# EAGLE design Softkey-bar (EAGLE 9.6.2)
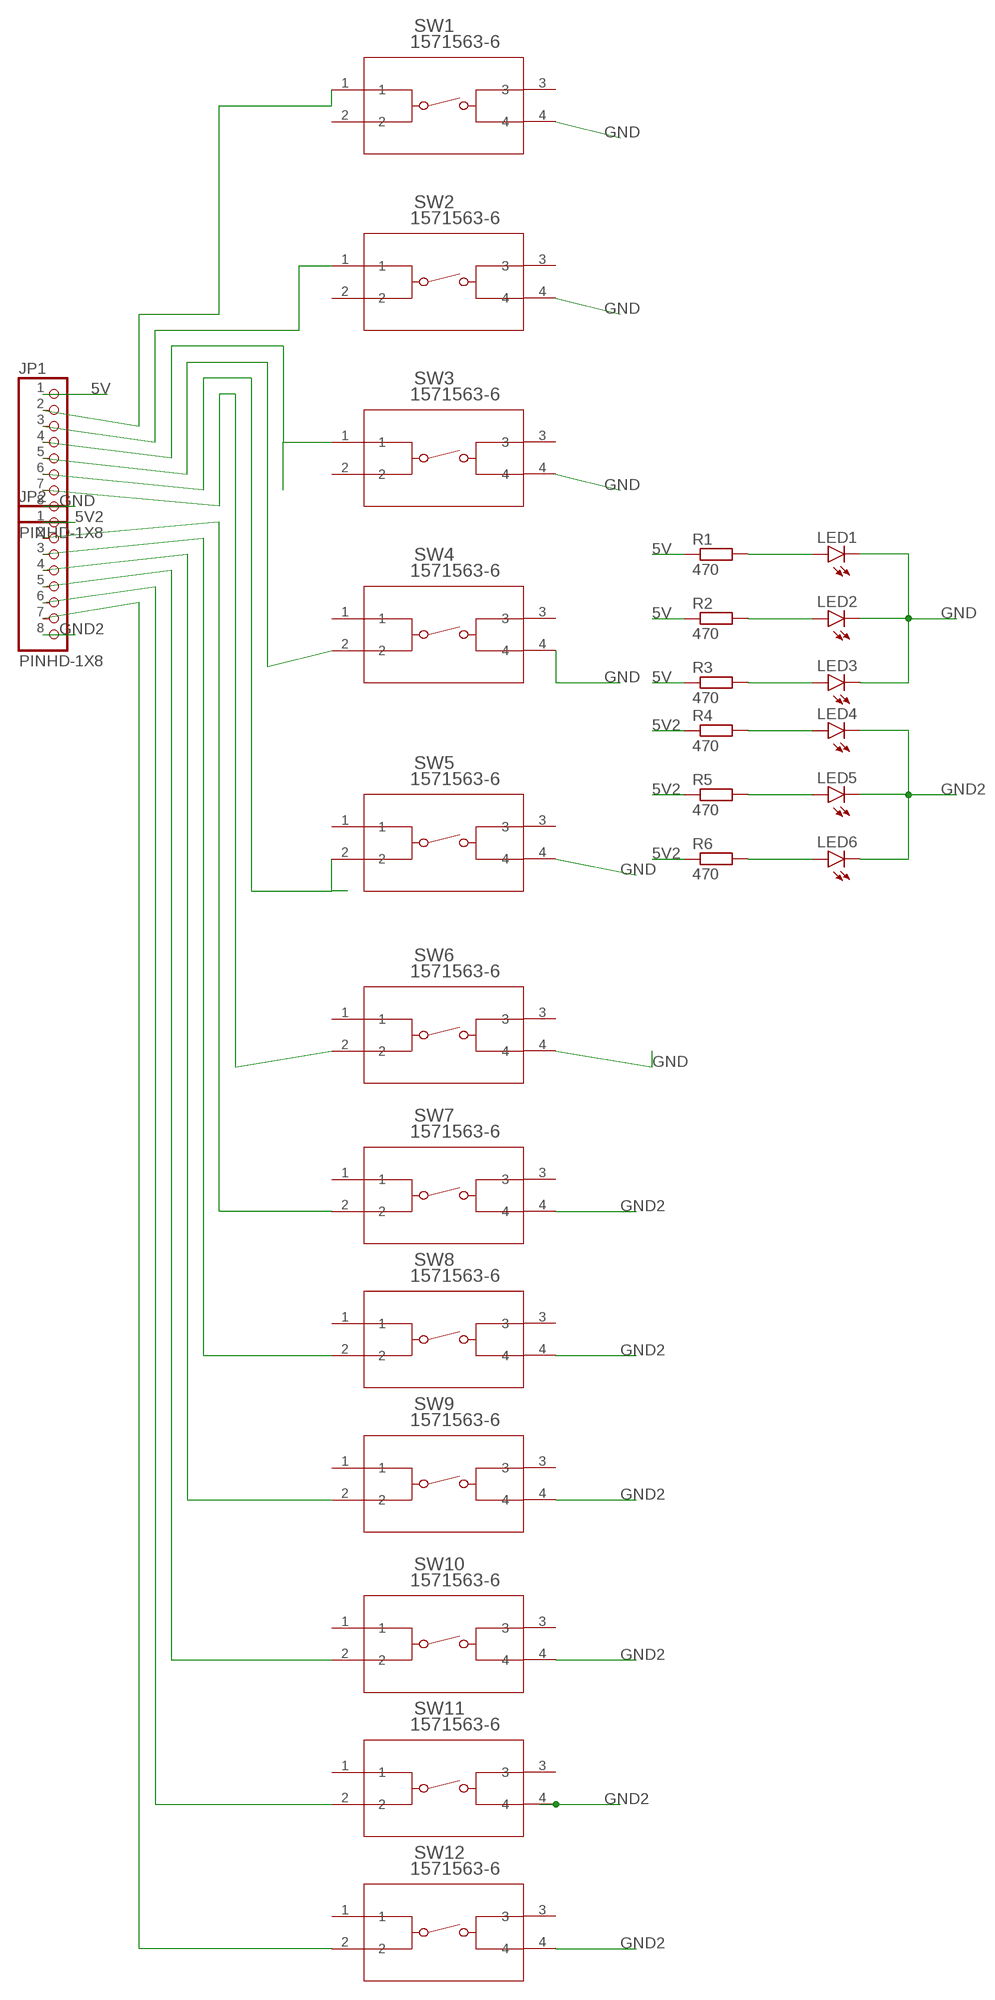
[diagram p0: schematic, sheet 1]

## Parts
JP1  PINHD-1X8  [1X08]
JP2  PINHD-1X8  [1X08]
LED1  LEDCHIPLED_1206  [CHIPLED_1206]
LED2  LEDCHIPLED_1206  [CHIPLED_1206]
LED3  LEDCHIPLED_1206  [CHIPLED_1206]
LED4  LEDCHIPLED_1206  [CHIPLED_1206]
LED5  LEDCHIPLED_1206  [CHIPLED_1206]
LED6  LEDCHIPLED_1206  [CHIPLED_1206]
R1  470  R-EU_R0805  [R0805]
R2  470  R-EU_R0805  [R0805]
R3  470  R-EU_R0805  [R0805]
R4  470  R-EU_R0805  [R0805]
R5  470  R-EU_R0805  [R0805]
R6  470  R-EU_R0805  [R0805]
SW1  1571563-6  [SW4_1437565-E]
SW2  1571563-6  [SW4_1437565-E]
SW3  1571563-6  [SW4_1437565-E]
SW4  1571563-6  [SW4_1437565-E]
SW5  1571563-6  [SW4_1437565-E]
SW6  1571563-6  [SW4_1437565-E]
SW7  1571563-6  [SW4_1437565-E]
SW8  1571563-6  [SW4_1437565-E]
SW9  1571563-6  [SW4_1437565-E]
SW10  1571563-6  [SW4_1437565-E]
SW11  1571563-6  [SW4_1437565-E]
SW12  1571563-6  [SW4_1437565-E]

## Nets
5V: JP1.1 R1.1 R2.1 R3.1
5V2: JP2.1 R4.1 R5.1 R6.1
GND: JP1.8 LED1.C LED2.C LED3.C SW1.4 SW2.4 SW3.4 SW4.4 SW5.4 SW6.4
GND2: JP2.8 LED4.C LED5.C LED6.C SW7.4 SW8.4 SW9.4 SW10.4 SW11.4 SW12.4
N$1: JP1.2 SW1.1
N$2: JP1.3 SW2.1
N$3: JP1.4 SW3.1
N$4: JP1.5 SW4.2
N$5: JP1.6 SW5.2
N$6: JP1.7 SW6.2
N$7: LED1.A R1.2
N$8: LED2.A R2.2
N$9: LED3.A R3.2
N$10: LED4.A R4.2
N$11: LED5.A R5.2
N$12: LED6.A R6.2
N$16: JP2.2 SW7.2
N$17: JP2.3 SW8.2
N$18: JP2.4 SW9.2
N$19: JP2.5 SW10.2
N$20: JP2.6 SW11.2
N$21: JP2.7 SW12.2
Unconnected: SW1.2 SW1.3 SW2.2 SW2.3 SW3.2 SW3.3 SW4.1 SW4.3 SW5.1 SW5.3 SW6.1 SW6.3 SW7.1 SW7.3 SW8.1 SW8.3 SW9.1 SW9.3 SW10.1 SW10.3 SW11.1 SW11.3 SW12.1 SW12.3

## Library data of the parts
JP1 JP2 = Connector:PINHD-1X8: PIN HEADER; CATEGORY: CONNECTOR; SUB-CATEGORY: PIN-HEADER
LED1-LED6 = led:LED: LED OSRAM: - CHIPLED LG R971, LG N971, LY N971, LG Q971, LY Q971, LO R971, LY R971 LH N974, LH R974 LS Q976, LO Q976, LY Q976 LO Q996 - Hyper CHIPLED LW Q18S LB Q993, LB Q99A, LB R99A - SideLED LS A670, LO A670, LY A670, LG A670, LP A670 LB A673, LV A673, LT A673, LW A673 LH A674 LY A675 LS A676, LA A676, LO A676, LY A676, LW A676 LS A679, LY A679, LG A679 - Hyper Micro SIDELED® LS Y876, LA Y876, LO Y876, LY Y876 LT Y87S - SmartLED LW L88C, LW L88S LB L89C, LB L89S, LG L890 LS L89K, LO L89K, LY L89K LS L896, LA L896, LO L896, LY L896 - TOPLED LS T670, LO T670, LY T670, LG T670, LP T670 LSG T670, LSP T670, LSY T670, LOP T670, LYG T670 LG T671, LOG T671, LSG T671 LB T673, LV T673, LT T673, LW T673 LH T674 LS T676, LA T676, LO T676, LY T676, LB T676, LH T676, LSB T676, LW T676 LB T67C, LV T67C, LT T67C, LS T67K, LO T67K, LY T67K, LW E67C LS E67B, LA E67B, LO E67B, LY E67B, LB E67C, LV E67C, LT E67C LW T67C LS T679, LY T679, LG T679 LS T770, LO T770, LY T770, LG T770, LP T770 LB T773, LV T773, LT T773, LW T773 LH T774 LS E675, LA E675, LY E675, LS T675 LS T776, LA T776, LO T776, LY T776, LB T776 LHGB T686 LT T68C, LB T68C - Hyper Mini TOPLED® LB M676 - Mini TOPLED Santana® LG M470 LS M47K, LO M47K, LY M47K Source: http://www.osram.convergy.de LUXEON: - LUMILED® LXK2-PW12-R00, LXK2-PW12-S00, LXK2-PW14-U00, LXK2-PW14-V00 LXK2-PM12-R00, LXK2-PM12-S00, LXK2-PM14-U00 LXK2-PE12-Q00, LXK2-PE12-R00, LXK2-PE12-S00, LXK2-PE14-T00, LXK2-PE14-U00 LXK2-PB12-K00, LXK2-PB12-L00, LXK2-PB12-M00, LXK2-PB14-N00, LXK2-PB14-P00, LXK2-PB14-Q00 LXK2-PR12-L00, LXK2-PR12-M00, LXK2-PR14-Q00, LXK2-PR14-R00 LXK2-PD12-Q00, LXK2-PD12-R00, LXK2-PD12-S00 LXK2-PH12-R00, LXK2-PH12-S00 LXK2-PL12-P00, LXK2-PL12-Q00, LXK2-PL12-R00 Source: www.luxeon.com KINGBRIGHT: KA-3528ASYC Source: www.kingbright.com
R1-R6 = rcl:R-EU_: RESISTOR, European symbol; SPICEPREFIX: R
SW1-SW12 = Switches:1571563-6; BUILT_BY: EMA_UL_Team; CATEGORY: Tactile Switches; COPYRIGHT: Copyright (C) 2016 Accelerated Designs. All rights reserved; DESCRIPTION: FSM14JSMAATR=TACT,SMT,T&R; MANUFACTURER_PART_NUMBER: 1571563-6; PART_STATUS: active; SERIES: Alcoswitch FSMJSMA; VENDOR: TE Connectivity

## Board
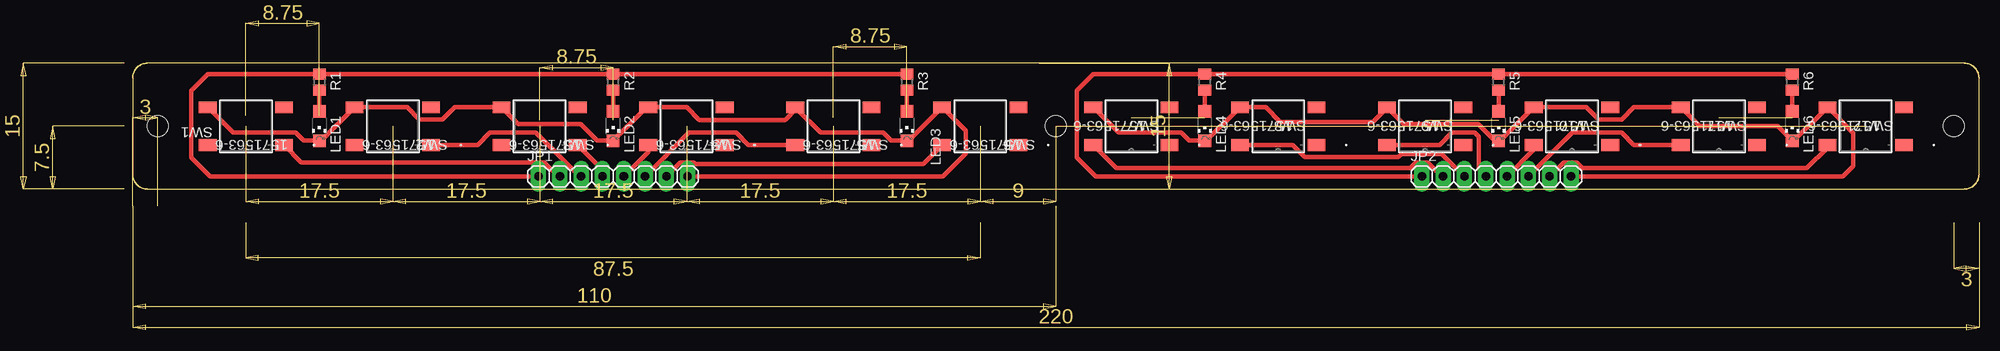
[diagram p1: board, top side]

Size 220 x 15 mm. Coordinates in mm from the lower left corner, seen from the top.
Outline: 220,1.75 220,13.25 arc90 218.25,15 1.75,15 arc90 0,13.25 0,1.75 arc90 1.75,0 218.25,0 arc90 220,1.75
Copper layers (1*16): Top 0.035mm / dielectric 1.5mm / Bottom 0.035mm
Design rules "swidzi_milling_3018_tht_test": minimum track width 20mil, minimum drill 0.8mm, track to track 20mil, track to pad 20mil, pad to pad 24mil, via to via 6mil, smd to smd 6mil, copper to edge 15mil, drill to drill 6mil, minimum pad ring 10mil, minimum via ring 8mil, stop-mask expansion 4mil, vias tented up to drill 0mil, thermal gap 10mil
Holes 2.5 mm at 110,7.5 217,7.5 3,7.5

### Footprints (pad centres in the part's own frame; a part is rotated, then mirrored left to right if it is on the bottom)
1X08 = drill 1.016 long: 1 -8.89,0; 2 -6.35,0; 3 -3.81,0; 4 -1.27,0; 5 1.27,0; 6 3.81,0; 7 6.35,0; 8 8.89,0
CHIPLED_1206 = smd 1.5 x 1.5: A 0,-1.75; C 0,1.75
R0805 = smd 1.3 x 1.5: 1 -0.95,0; 2 0.95,0
SW4_1437565-E = smd 2.108 x 1.397: 1 -4.55,2.25; 2 4.55,2.25; 3 -4.55,-2.25; 4 4.55,-2.25

### Placement (x,y rotation side)
JP1  57.25,1.5 0 top
JP2  162.5,1.5 0 top
LED1  22.25,7.5 180 top
LED2  57.25,7.5 180 top
LED3  92.25,7.5 180 top
LED4  127.75,7.5 180 top
LED5  162.75,7.5 180 top
LED6  197.75,7.5 180 top
R1  22.25,12.75 270 top
R2  57.25,12.75 270 top
R3  92.25,12.75 270 top
R4  127.75,12.75 270 top
R5  162.75,12.75 270 top
R6  197.75,12.75 270 top
SW1  13.5,7.5 180 top
SW2  31,7.5 180 top
SW3  48.5,7.5 180 top
SW4  66,7.5 180 top
SW5  83.5,7.5 180 top
SW6  101,7.5 180 top
SW7  119,7.5 180 top
SW8  136.5,7.5 180 top
SW9  154,7.5 180 top
SW10  171.5,7.5 180 top
SW11  189,7.5 180 top
SW12  206.5,7.5 180 top

### Tracks (layer width: path | path; a pad name or v marks a point on that pad's centre or on a via)
5V
  Top 0.508: JP1.1 9.25,1.5 7,3.75 7,11.75 8.95,13.7 R1.1 R2.1 R3.1
5V2
  Top 0.508: JP2.1 114.75,1.5 112.5,3.75 112.5,11.75 114.45,13.7 R4.1 R5.1 R6.1
GND
  Top 0.508: JP1.8 96.5,1.5 99.25,4.25 99.25,6.95 SW6.4 92.45,5.75 LED3.C 90.38,5.75 89.42,6.71 81.99,6.71 79.1,9.6 | 79.1,9.6 SW5.4 | SW1.4 11.99,6.71 19.42,6.71 20.38,5.75 LED1.C 22.45,5.75 SW2.4 32.72,9.75 34.18,8.29 36.92,8.29 38.38,9.75 SW3.4 45.97,7.73 53.4,7.73 55.38,5.75 LED2.C 61.25,9.75 SW4.4 66,9.75 67.5,8.25 77.75,8.25 79.1,9.6
GND2
  Top 0.508: JP2.8 203.75,1.5 205,2.75 205,6.7 SW12.4 197.95,5.75 LED6.C 196,7.5 186.7,7.5 SW11.4 178.88,9.75 177.42,8.29 174.68,8.29 173.22,9.75 SW10.4 162.95,5.75 LED5.C 162.32,5.75 160.34,7.73 151.47,7.73 149.47,9.72 | 149.47,9.72 SW9.4 | 149.47,9.72 147.75,8 136.75,8 135,9.75 SW8.4 127.95,5.75 LED4.C 125.88,5.75 124.92,6.71 117.49,6.71 SW7.4
N$1
  Top 0.508: JP1.2 50.73,1.5 49.05,3.18 20.12,3.18 SW1.1
N$2
  Top 0.508: JP1.3 53.27,1.5 48.06,6.71 42.58,6.71 41.12,5.25 SW2.1
N$3
  Top 0.508: JP1.4 55.98,2.32 SW3.1
N$4
  Top 0.508: JP1.5 61.45,4.43 SW4.2
N$5
  Top 0.508: SW5.2 73.38,5.25 71.92,6.71 66.27,6.71 JP1.6
N$6
  Top 0.508: JP1.7 65.28,3.18 66.83,3.18 67.01,3 94.2,3 SW6.2
N$7
  Top 0.508: LED1.A R1.2
N$8
  Top 0.508: R2.2 LED2.A
N$9
  Top 0.508: R3.2 LED3.A
N$10
  Top 0.508: LED4.A R4.2
N$11
  Top 0.508: LED5.A R5.2
N$12
  Top 0.508: LED6.A R6.2
N$16
  Top 0.508: JP2.2 155.98,1.5 154.3,3.18 152.92,3.18 152.25,2.52 117.18,2.52 SW7.2
N$17
  Top 0.508: SW8.2 138.22,5.25 139.68,3.79 150.82,3.79 151.22,4.19 156,4.19 JP2.3
N$18
  Top 0.508: JP2.4 160.37,2.36 160.37,6.26 159.92,6.71 157.18,6.71 155.72,5.25 SW9.2
N$19
  Top 0.508: JP2.5 166.95,4.68 SW10.2
N$20
  Top 0.508: SW11.2 178.88,5.25 177.42,6.71 171.52,6.71 JP2.6
N$21
  Top 0.508: JP2.7 170.53,3.18 172.08,3.18 172.75,2.52 199.5,2.52 201.95,4.97 SW12.2